# Altium schematic sheet ngp-main.SchDoc
size A3
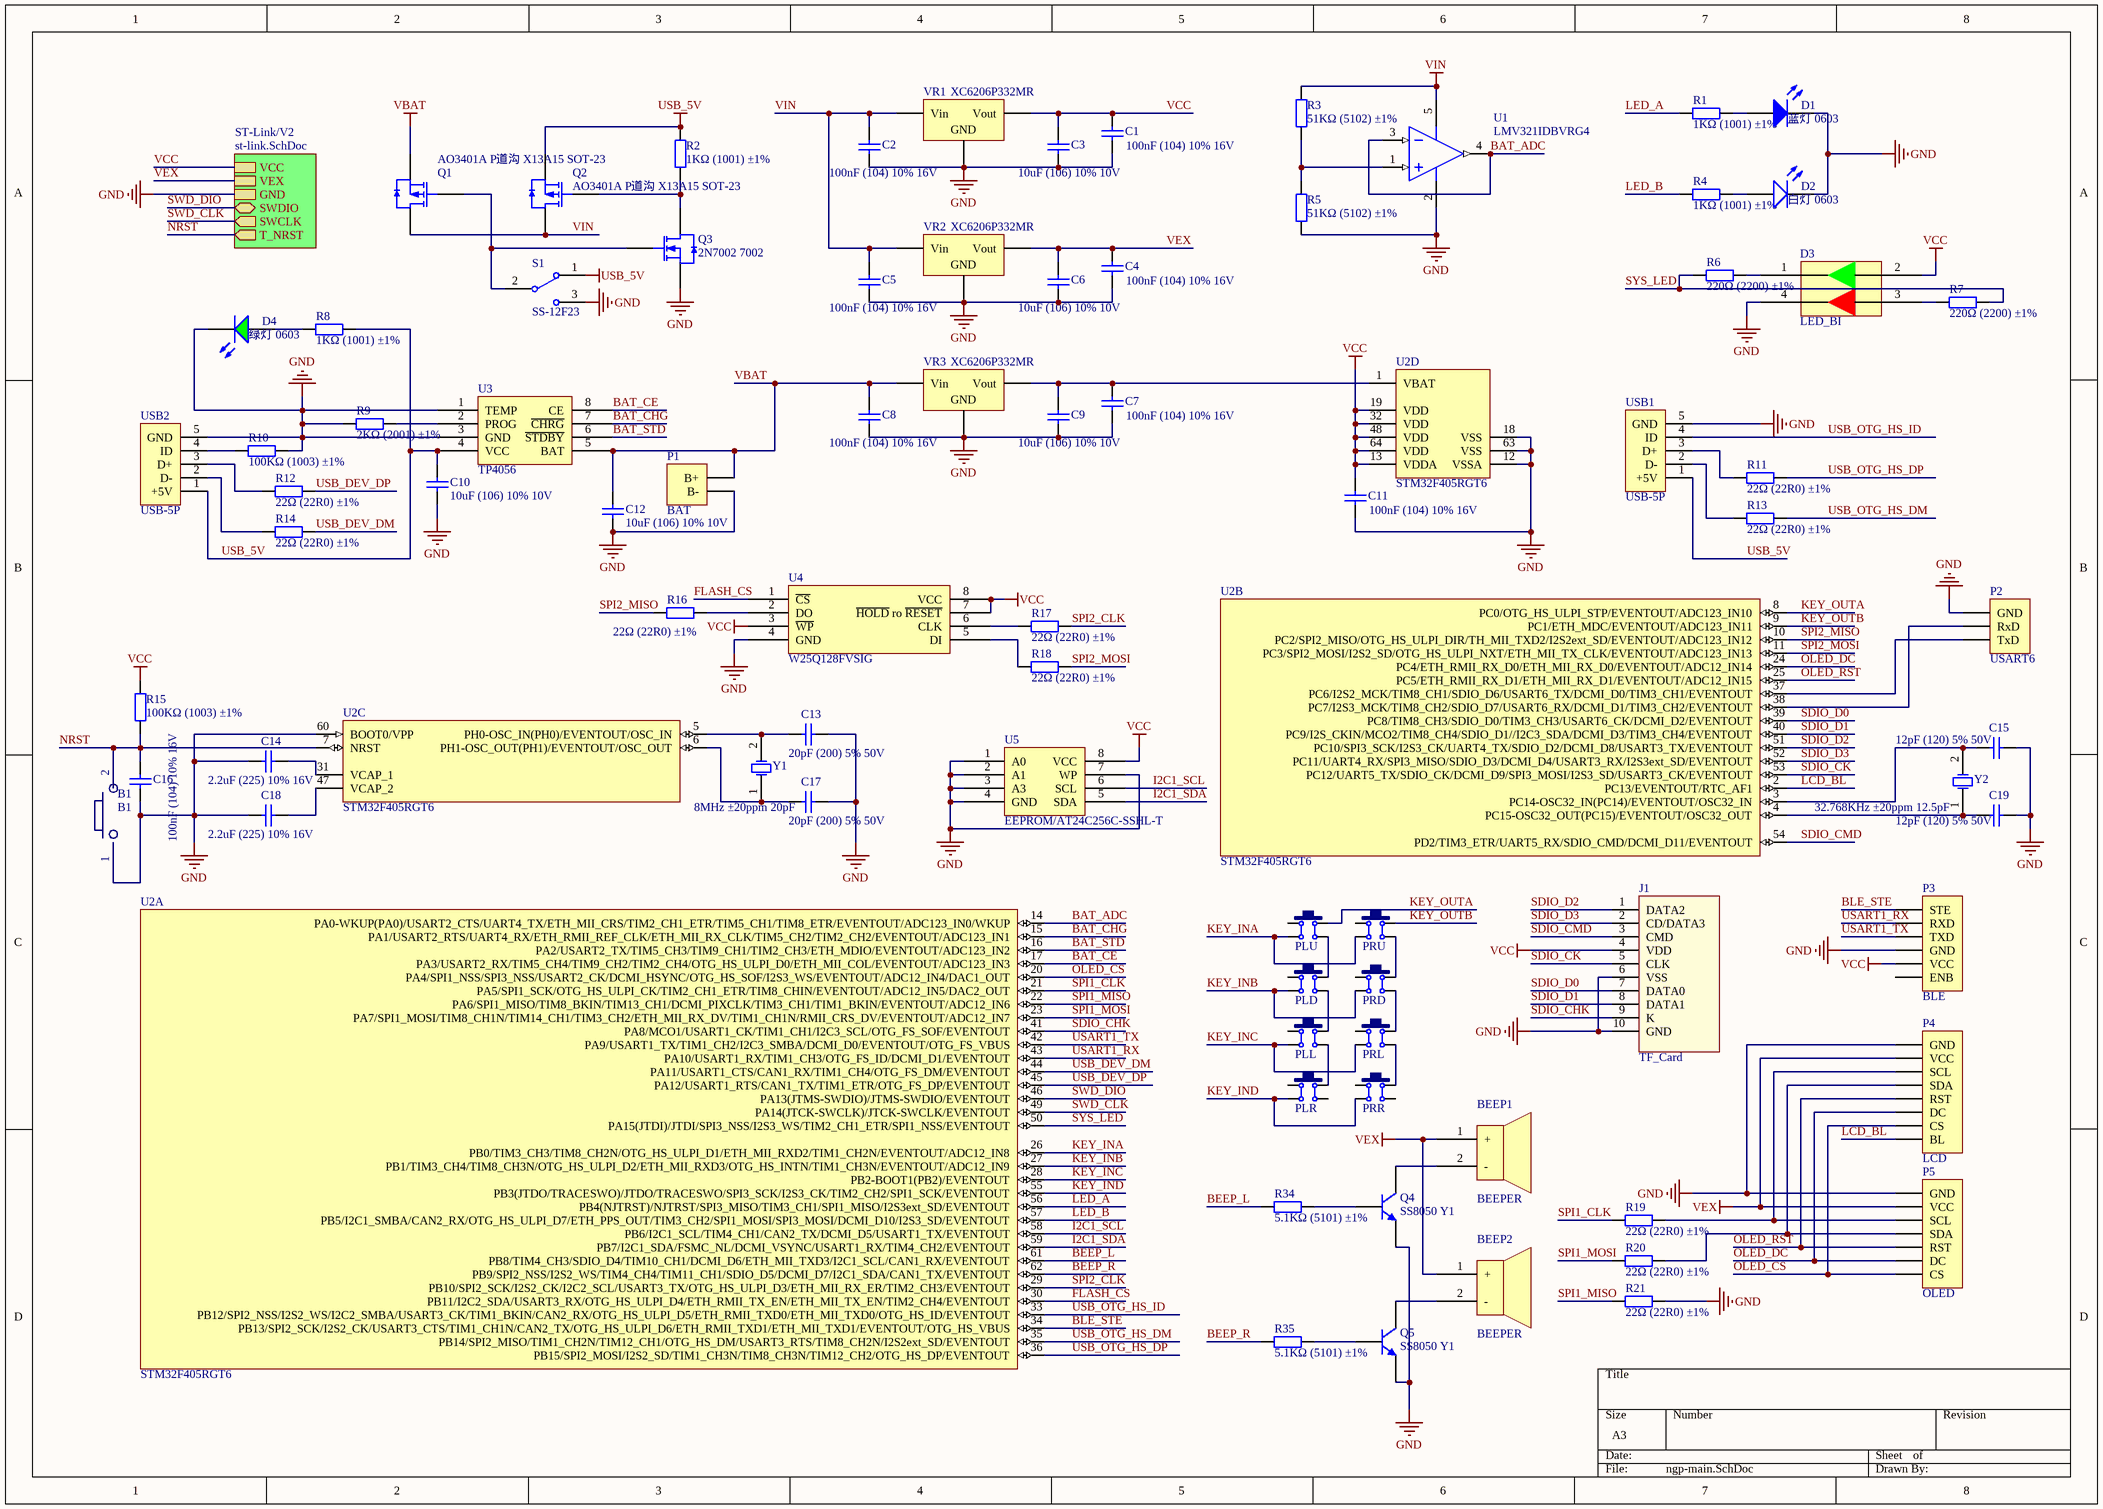
[diagram p0: ngp-main.SchDoc]

## Parts
B1  B1  [MetalButton]
BEEP1  BEEPER  [BEEPER]
BEEP2  BEEPER  [BEEPER]
C1  100nF (104) 10% 16V  [0402_C]
C2  100nF (104) 10% 16V  [0402_C]
C3  10uF (106) 10% 10V  [0603_C]
C4  100nF (104) 10% 16V  [0402_C]
C5  100nF (104) 10% 16V  [0402_C]
C6  10uF (106) 10% 10V  [0603_C]
C7  100nF (104) 10% 16V  [0402_C]
C8  100nF (104) 10% 16V  [0402_C]
C9  10uF (106) 10% 10V  [0603_C]
C10  10uF (106) 10% 10V  [0603_C]
C11  100nF (104) 10% 16V  [0402_C]
C12  10uF (106) 10% 10V  [0603_C]
C13  20pF (200) 5% 50V  [0402_C]
C14  2.2uF (225) 10% 16V  [0603_C]
C15  12pF (120) 5% 50V  [0402_C]
C16  100nF (104) 10% 16V  [0402_C]
C17  20pF (200) 5% 50V  [0402_C]
C18  2.2uF (225) 10% 16V  [0603_C]
C19  12pF (120) 5% 50V  [0402_C]
D1  蓝灯 0603  [0603_LED_S1]
D2  白灯 0603  [0603_LED_S1]
D3  LED_BI  [LED_BI]
D4  绿灯 0603  [0603_LED_S1]
J1  TF_Card  [Micro SD]
P1  BAT  [HDR1X2]
P2  USART6  [HDR1X3H]
P3  BLE  [HDR1X6]
P4  LCD  [HDR1X8]
P5  OLED  [HDR1X7]
PLD  6x6x5  [TSW SMD-6*6*5]  (value not drawn)
PLL  6x6x5  [TSW SMD-6*6*5]  (value not drawn)
PLR  6x6x5  [TSW SMD-6*6*5]  (value not drawn)
PLU  6x6x5  [TSW SMD-6*6*5]  (value not drawn)
PRD  6x6x5  [TSW SMD-6*6*5]  (value not drawn)
PRL  6x6x5  [TSW SMD-6*6*5]  (value not drawn)
PRR  6x6x5  [TSW SMD-6*6*5]  (value not drawn)
PRU  6x6x5  [TSW SMD-6*6*5]  (value not drawn)
Q1  AO3401A P道沟 X13A15 SOT-23  [SOT-23-3L]
Q2  AO3401A P道沟 X13A15 SOT-23  [SOT-23-3L]
Q3  2N7002 7002  [SOT-23(SOT-23-3)]
Q4  SS8050 Y1  [SOT-23(SOT-23-3)]
Q5  SS8050 Y1  [SOT-23(SOT-23-3)]
R1  1KΩ (1001) ±1%  [0402_R]
R2  1KΩ (1001) ±1%  [0402_R]
R3  51KΩ (5102) ±1%  [0402_R]
R4  1KΩ (1001) ±1%  [0402_R]
R5  51KΩ (5102) ±1%  [0402_R]
R6  220Ω (2200) ±1%  [0402_R]
R7  220Ω (2200) ±1%  [0402_R]
R8  1KΩ (1001) ±1%  [0402_R]
R9  2KΩ (2001) ±1%  [0402_R]
R10  100KΩ (1003) ±1%  [0402_R]
R11  22Ω (22R0) ±1%  [0402_R]
R12  22Ω (22R0) ±1%  [0402_R]
R13  22Ω (22R0) ±1%  [0402_R]
R14  22Ω (22R0) ±1%  [0402_R]
R15  100KΩ (1003) ±1%  [0402_R]
R16  22Ω (22R0) ±1%  [0402_R]
R17  22Ω (22R0) ±1%  [0402_R]
R18  22Ω (22R0) ±1%  [0402_R]
R19  22Ω (22R0) ±1%  [0402_R]
R20  22Ω (22R0) ±1%  [0402_R]
R21  22Ω (22R0) ±1%  [0402_R]
R34  5.1KΩ (5101) ±1%  [0402_R]
R35  5.1KΩ (5101) ±1%  [0402_R]
S1  SS-12F23  [MSK-12C01-07]
U1  LMV321IDBVRG4  [SOT-23-5]
U2  STM32F405RGT6  [LQFP-64_10x10x05P]  (parts A,B,C,D of 4)
U3  TP4056  [SOP-8_EP_150mil]
U4  W25Q128FVSIG  [SOIC-8_208mil]
U5  EEPROM/AT24C256C-SSHL-T  [SOIC-8_150mil]
USB1  USB-5P  [USB-MICRO_D]
USB2  USB-5P  [USB-MICRO_D]
VR1  XC6206P332MR  [SOT-23-3L]
VR2  XC6206P332MR  [SOT-23-3L]
VR3  XC6206P332MR  [SOT-23-3L]
Y1  8MHz ±20ppm 20pF  [SMD-5032_2P]
Y2  32.768KHz ±20ppm 12.5pF  [SMD-3215_2P FC - 135]

## Sub-sheets
ST-Link/V2 = st-link.SchDoc: VCC, VEX, GND, SWDIO (bidir), SWCLK (out), T_NRST (out)

## Nets
GND: B1.1 C1.1 C2.1 C3.2 C4.1 C5.1 C6.2 C7.1 C8.1 C9.2 C10.1 C11.1 C12.2 C13.2 C14.1 C15.2 C16.1 C17.2 C18.1 C19.2 D1.K D2.K D3.4 D4.K J1.6(VSS) J1.10(GND) P1.1(B-) P2.1(GND) P3.4(GND) P4.1(GND) P5.1(GND) Q3.2(S) Q4.2(E) Q5.2(E) R5.1 R9.1 R10.2 R21.2 S1.3 U1.2(V-) U2.12(VSSA) U2.18(VSS) U2.60(BOOT0/VPP) U2.63(VSS) U3.1(TEMP) U3.3(GND) U4.4(GND) U5.1(A0) U5.2(A1) U5.3(A3) U5.4(GND) U5.7(WP) USB1.5(GND) USB2.5(GND) VR1.1(GND) VR2.1(GND) VR3.1(GND) ; sheet ST-Link/V2/GND
USB_5V: C10.2 Q2.2(S) R2.1 R8.1 S1.1 U3.4(VCC) USB1.1(+5V) USB2.1(+5V)
VBAT: C8.2 C12.1 P1.2(B+) Q1.2(S) U3.5(BAT) VR3.3(Vin)
VCC: C1.2 C3.1 C11.2 D3.2 J1.4(VDD) P3.5(VCC) R15.2 U2.13(VDDA) U2.19(VDD) U2.32(VDD) U2.48(VDD) U2.64(VDD) U4.3(~{WP}) U4.7(~{HOLD}_ro_~{RESET}) U4.8(VCC) U5.8(VCC) VR1.2(Vout) ; sheet ST-Link/V2/VCC
VEX: BEEP1.1(+) BEEP2.1(+) C4.2 C6.1 P4.2(VCC) P5.2(VCC) VR2.2(Vout) ; sheet ST-Link/V2/VEX
VIN: C2.2 C5.2 Q1.3(D) Q2.3(D) R3.2 U1.5(V+) VR1.3(Vin) VR2.3(Vin)
BAT_ADC: U1.3(IN-) U1.4(OUT) U2.14(PA0-WKUP(PA0)/USART2_CTS/UART4_TX/ETH_MII_CRS/TIM2_CH1_ETR/TIM5_CH1/TIM8_ETR/EVENTOUT/ADC123_IN0/WKUP)
BAT_CE: U2.17(PA3/USART2_RX/TIM5_CH4/TIM9_CH2/TIM2_CH4/OTG_HS_ULPI_D0/ETH_MII_COL/EVENTOUT/ADC123_IN3) U3.8(CE)
BAT_CHG: U2.15(PA1/USART2_RTS/UART4_RX/ETH_RMII_REF_CLK/ETH_MII_RX_CLK/TIM5_CH2/TIM2_CH2/EVENTOUT/ADC123_IN1) U3.7(~{CHRG})
BAT_STD: U2.16(PA2/USART2_TX/TIM5_CH3/TIM9_CH1/TIM2_CH3/ETH_MDIO/EVENTOUT/ADC123_IN2) U3.6(~{STDBY})
BEEP_L: R34.1 U2.61(PB8/TIM4_CH3/SDIO_D4/TIM10_CH1/DCMI_D6/ETH_MII_TXD3/I2C1_SCL/CAN1_RX/EVENTOUT)
BEEP_R: R35.1 U2.62(PB9/SPI2_NSS/I2S2_WS/TIM4_CH4/TIM11_CH1/SDIO_D5/DCMI_D7/I2C1_SDA/CAN1_TX/EVENTOUT)
BLE_STE: P3.1(STE) U2.34(PB13/SPI2_SCK/I2S2_CK/USART3_CTS/TIM1_CH1N/CAN2_TX/OTG_HS_ULPI_D6/ETH_RMII_TXD1/ETH_MII_TXD1/EVENTOUT/OTG_HS_VBUS)
FLASH_CS: U2.30(PB11/I2C2_SDA/USART3_RX/OTG_HS_ULPI_D4/ETH_RMII_TX_EN/ETH_MII_TX_EN/TIM2_CH4/EVENTOUT) U4.1(~{CS})
I2C1_SCL: U2.58(PB6/I2C1_SCL/TIM4_CH1/CAN2_TX/DCMI_D5/USART1_TX/EVENTOUT) U5.6(SCL)
I2C1_SDA: U2.59(PB7/I2C1_SDA/FSMC_NL/DCMI_VSYNC/USART1_RX/TIM4_CH2/EVENTOUT) U5.5(SDA)
KEY_INA: PLU.4 PRU.4 U2.26(PB0/TIM3_CH3/TIM8_CH2N/OTG_HS_ULPI_D1/ETH_MII_RXD2/TIM1_CH2N/EVENTOUT/ADC12_IN8)
KEY_INB: PLD.4 PRD.4 U2.27(PB1/TIM3_CH4/TIM8_CH3N/OTG_HS_ULPI_D2/ETH_MII_RXD3/OTG_HS_INTN/TIM1_CH3N/EVENTOUT/ADC12_IN9)
KEY_INC: PLL.4 PRL.4 U2.28(PB2-BOOT1(PB2)/EVENTOUT)
KEY_IND: PLR.4 PRR.4 U2.55(PB3(JTDO/TRACESWO)/JTDO/TRACESWO/SPI3_SCK/I2S3_CK/TIM2_CH2/SPI1_SCK/EVENTOUT)
KEY_OUTA: PLU.2 U2.8(PC0/OTG_HS_ULPI_STP/EVENTOUT/ADC123_IN10)
KEY_OUTB: PRU.2 U2.9(PC1/ETH_MDC/EVENTOUT/ADC123_IN11)
LCD_BL: P4.8(BL) U2.2(PC13/EVENTOUT/RTC_AF1)
LED_A: R1.2 U2.56(PB4(NJTRST)/NJTRST/SPI3_MISO/TIM3_CH1/SPI1_MISO/I2S3ext_SD/EVENTOUT)
LED_B: R4.2 U2.57(PB5/I2C1_SMBA/CAN2_RX/OTG_HS_ULPI_D7/ETH_PPS_OUT/TIM3_CH2/SPI1_MOSI/SPI3_MOSI/DCMI_D10/I2S3_SD/EVENTOUT)
NRST: B1.2 C16.2 R15.1 U2.7(NRST) ; sheet ST-Link/V2/T_NRST
OLED_CS: P4.7(CS) P5.7(CS) U2.20(PA4/SPI1_NSS/SPI3_NSS/USART2_CK/DCMI_HSYNC/OTG_HS_SOF/I2S3_WS/EVENTOUT/ADC12_IN4/DAC1_OUT)
OLED_DC: P4.6(DC) P5.6(DC) U2.24(PC4/ETH_RMII_RX_D0/ETH_MII_RX_D0/EVENTOUT/ADC12_IN14)
OLED_RST: P4.5(RST) P5.5(RST) U2.25(PC5/ETH_RMII_RX_D1/ETH_MII_RX_D1/EVENTOUT/ADC12_IN15)
SDIO_CHK: J1.9(K) U2.41(PA8/MCO1/USART1_CK/TIM1_CH1/I2C3_SCL/OTG_FS_SOF/EVENTOUT)
SDIO_CK: J1.5(CLK) U2.53(PC12/UART5_TX/SDIO_CK/DCMI_D9/SPI3_MOSI/I2S3_SD/USART3_CK/EVENTOUT)
SDIO_CMD: J1.3(CMD) U2.54(PD2/TIM3_ETR/UART5_RX/SDIO_CMD/DCMI_D11/EVENTOUT)
SDIO_D0: J1.7(DATA0) U2.39(PC8/TIM8_CH3/SDIO_D0/TIM3_CH3/USART6_CK/DCMI_D2/EVENTOUT)
SDIO_D1: J1.8(DATA1) U2.40(PC9/I2S_CKIN/MCO2/TIM8_CH4/SDIO_D1//I2C3_SDA/DCMI_D3/TIM3_CH4/EVENTOUT)
SDIO_D2: J1.1(DATA2) U2.51(PC10/SPI3_SCK/I2S3_CK/UART4_TX/SDIO_D2/DCMI_D8/USART3_TX/EVENTOUT)
SDIO_D3: J1.2(CD/DATA3) U2.52(PC11/UART4_RX/SPI3_MISO/SDIO_D3/DCMI_D4/USART3_RX/I2S3ext_SD/EVENTOUT)
SPI1_CLK: R19.1 U2.21(PA5/SPI1_SCK/OTG_HS_ULPI_CK/TIM2_CH1_ETR/TIM8_CHIN/EVENTOUT/ADC12_IN5/DAC2_OUT)
SPI1_MISO: R21.1 U2.22(PA6/SPI1_MISO/TIM8_BKIN/TIM13_CH1/DCMI_PIXCLK/TIM3_CH1/TIM1_BKIN/EVENTOUT/ADC12_IN6)
SPI1_MOSI: R20.1 U2.23(PA7/SPI1_MOSI/TIM8_CH1N/TIM14_CH1/TIM3_CH2/ETH_MII_RX_DV/TIM1_CH1N/RMII_CRS_DV/EVENTOUT/ADC12_IN7)
SPI2_CLK: R17.2 U2.29(PB10/SPI2_SCK/I2S2_CK/I2C2_SCL/USART3_TX/OTG_HS_ULPI_D3/ETH_MII_RX_ER/TIM2_CH3/EVENTOUT)
SPI2_MISO: R16.1 U2.10(PC2/SPI2_MISO/OTG_HS_ULPI_DIR/TH_MII_TXD2/I2S2ext_SD/EVENTOUT/ADC123_IN12)
SPI2_MOSI: R18.2 U2.11(PC3/SPI2_MOSI/I2S2_SD/OTG_HS_ULPI_NXT/ETH_MII_TX_CLK/EVENTOUT/ADC123_IN13)
SWD_CLK: U2.49(PA14(JTCK-SWCLK)/JTCK-SWCLK/EVENTOUT) ; sheet ST-Link/V2/SWCLK
SWD_DIO: U2.46(PA13(JTMS-SWDIO)/JTMS-SWDIO/EVENTOUT) ; sheet ST-Link/V2/SWDIO
SYS_LED: R6.1 R7.2 U2.50(PA15(JTDI)/JTDI/SPI3_NSS/I2S3_WS/TIM2_CH1_ETR/SPI1_NSS/EVENTOUT)
USART1_RX: P3.2(RXD) U2.43(PA10/USART1_RX/TIM1_CH3/OTG_FS_ID/DCMI_D1/EVENTOUT)
USART1_TX: P3.3(TXD) U2.42(PA9/USART1_TX/TIM1_CH2/I2C3_SMBA/DCMI_D0/EVENTOUT/OTG_FS_VBUS)
USB_DEV_DM: R14.2 U2.44(PA11/USART1_CTS/CAN1_RX/TIM1_CH4/OTG_FS_DM/EVENTOUT)
USB_DEV_DP: R12.2 U2.45(PA12/USART1_RTS/CAN1_TX/TIM1_ETR/OTG_FS_DP/EVENTOUT)
USB_OTG_HS_DM: R13.2 U2.35(PB14/SPI2_MISO/TIM1_CH2N/TIM12_CH1/OTG_HS_DM/USART3_RTS/TIM8_CH2N/I2S2ext_SD/EVENTOUT)
USB_OTG_HS_DP: R11.2 U2.36(PB15/SPI2_MOSI/I2S2_SD/TIM1_CH3N/TIM8_CH3N/TIM12_CH2/OTG_HS_DP/EVENTOUT)
USB_OTG_HS_ID: U2.33(PB12/SPI2_NSS/I2S2_WS/I2C2_SMBA/USART3_CK/TIM1_BKIN/CAN2_RX/OTG_HS_ULPI_D5/ETH_RMII_TXD0/ETH_MII_TXD0/OTG_HS_ID/EVENTOUT) USB1.4(ID)
NetBEEP1_2: BEEP1.2(-) Q4.3(C)
NetBEEP2_2: BEEP2.2(-) Q5.3(C)
NetC7_2: C7.2 C9.1 U2.1(VBAT) VR3.2(Vout)
NetC13_1: C13.1 U2.5(PH0-OSC_IN(PH0)/EVENTOUT/OSC_IN) Y1.2(OSC2)
NetC14_2: C14.2 U2.31(VCAP_1)
NetC15_1: C15.1 U2.3(PC14-OSC32_IN(PC14)/EVENTOUT/OSC32_IN) Y2.2(OSC2)
NetC17_1: C17.1 U2.6(PH1-OSC_OUT(PH1)/EVENTOUT/OSC_OUT) Y1.1(OSC1)
NetC18_2: C18.2 U2.47(VCAP_2)
NetC19_1: C19.1 U2.4(PC15-OSC32_OUT(PC15)/EVENTOUT/OSC32_OUT) Y2.1(OSC1)
NetD1_A: D1.A R1.1
NetD2_A: D2.A R4.1
NetD3_1: D3.1 R6.2
NetD3_3: D3.3 R7.1
NetD4_A: D4.A R8.2
NetP2_2: P2.2(RxD) U2.38(PC7/I2S3_MCK/TIM8_CH2/SDIO_D7/USART6_RX/DCMI_D1/TIM3_CH2/EVENTOUT)
NetP2_3: P2.3(TxD) U2.37(PC6/I2S2_MCK/TIM8_CH1/SDIO_D6/USART6_TX/DCMI_D0/TIM3_CH1/EVENTOUT)
NetP4_3: P4.3(SCL) P5.3(SCL) R19.2
NetP4_4: P4.4(SDA) P5.4(SDA) R20.2
NetPLD_2: PLD.2 PLU.3
NetPLD_3: PLD.3 PLL.2
NetPLL_3: PLL.3 PLR.2
NetPRD_2: PRD.2 PRU.3
NetPRD_3: PRD.3 PRL.2
NetPRL_3: PRL.3 PRR.2
NetQ1_1: Q1.1(G) Q3.1(G) S1.2
NetQ2_1: Q2.1(G) Q3.3(D) R2.2
NetQ4_1: Q4.1(B) R34.2
NetQ5_1: Q5.1(B) R35.2
NetR3_1: R3.1 R5.2 U1.1(IN+)
NetR9_2: R9.2 U3.2(PROG)
NetR10_1: R10.1 USB2.4(ID)
NetR11_1: R11.1 USB1.3(D+)
NetR12_1: R12.1 USB2.3(D+)
NetR13_1: R13.1 USB1.2(D-)
NetR14_1: R14.1 USB2.2(D-)
NetR16_2: R16.2 U4.2(DO)
NetR17_1: R17.1 U4.6(CLK)
NetR18_1: R18.1 U4.5(DI)

Not connected (* = marked no-connect by the designer): P3 6(ENB); PLD 1; PLL 1; PLR 1 3; PLU 1; PRD 1; PRL 1; PRR 1 3; PRU 1

## Library data of the parts
B1 = MetalButton
C1 C2 C4 C5 C7 C8 C11 C16 = 0402 100nF (104) 10% 16V: 贴片电容; ComponentLink1Description: 供应商链接; ComponentLink1URL: http://www.szlcsc.com/product/details_1877.html; Package: 0402; Supplier: LC; SuppliersPartNumber: C1525
C3 C6 C9 C10 C12 = 0603 10uF (106) 10% 10V: 贴片电容; ComponentLink1Description: 供应商链接; ComponentLink1URL: http://www.szlcsc.com/product/details_20411.html; Package: 0603; Supplier: LC; SuppliersPartNumber: C19702
C13 C17 = 0402 20pF (200) 5% 50V: 贴片电容; ComponentLink1Description: 供应商链接; ComponentLink1URL: http://www.szlcsc.com/product/details_1906.html; Package: 0402; Supplier: LC; SuppliersPartNumber: C1554
C14 C18 = 0603 2.2uF (225) 10% 16V: 贴片电容; ComponentLink1Description: 供应商链接; ComponentLink1URL: http://www.szlcsc.com/product/details_24366.html; Package: 0603; Supplier: LC; SuppliersPartNumber: C23630
C15 C19 = 0402 12pF (120) 5% 50V: 贴片电容; ComponentLink1Description: 供应商链接; ComponentLink1URL: http://www.szlcsc.com/product/details_1899.html; Package: 0402; Supplier: LC; SuppliersPartNumber: C1547
D1 = 0603 蓝灯: 发光二极管; ComponentLink1Description: 供应商链接; ComponentLink1URL: http://www.szlcsc.com/product/details_73150.html; Package: 0603; Supplier: LC; SuppliersPartNumber: C72041
D2 = 0603 白灯: 发光二极管; ComponentLink1Description: 供应商链接; ComponentLink1URL: http://www.szlcsc.com/product/details_2663.html; Package: 0603; Supplier: LC; SuppliersPartNumber: C2290
D4 = 0603 绿灯: 发光二极管; ComponentLink1Description: 供应商链接; ComponentLink1URL: http://www.szlcsc.com/product/details_73152.html; Package: 0603; Supplier: LC; SuppliersPartNumber: C72043
J1 = TF_Card: TF卡座; 版权归属: 源创客; BOM名称: TF卡座; 学习资源: www.ooocke.com
P1 = Header 2: Header, 2-Pin; LatestRevisionDate: 17-Jul-2002; LatestRevisionNote: Re-released for DXP Platform.; Publisher: Altium Limited
P2 = Header 3H: Header, 3-Pin, Right Angle; LatestRevisionDate: 17-Jul-2002; LatestRevisionNote: Re-released for DXP Platform.; Publisher: Altium Limited
P3 = Header 6: Header, 6-Pin; LatestRevisionDate: 17-Jul-2002; LatestRevisionNote: Re-released for DXP Platform.; Publisher: Altium Limited
P4 = Header 8: Header, 8-Pin; LatestRevisionDate: 17-Jul-2002; LatestRevisionNote: Re-released for DXP Platform.; Publisher: Altium Limited
P5 = Header 7: Header, 7-Pin; LatestRevisionDate: 17-Jul-2002; LatestRevisionNote: Re-released for DXP Platform.; Publisher: Altium Limited
PLD PLL PLR PLU PRD PRL PRR PRU = TSW SMD-6x6: 贴片6x6轻触开关; 版权归属: 源创客; BOM名称: 贴片6x6轻触开关; 学习资源: www.ooocke.com
Q1 Q2 = AO3401A P道沟 X13A15 SOT-23: MOS(场效应管); ComponentLink1Description: 供应商链接; ComponentLink1URL: http://www.szlcsc.com/product/details_15801.html; Package: SOT-23; Supplier: LC; SuppliersPartNumber: C15127
Q3 = 2N7002 7002: MOS(场效应管); ComponentLink1Description: 供应商链接; ComponentLink1URL: http://www.szlcsc.com/product/details_9040.html; Package: SOT-23(SOT-23-3); Supplier: LC; SuppliersPartNumber: C8545
Q4 Q5 = SOT-23 SS8050 Y1: 三极管; ComponentLink1Description: 供应商链接; ComponentLink1URL: http://www.szlcsc.com/product/details_2507.html; Package: SOT-23; Supplier: LC; SuppliersPartNumber: C2150
R1 R2 R4 R8 = 0402 1KΩ (1001) 1%: 贴片电阻; ComponentLink1Description: 供应商链接; ComponentLink1URL: http://www.szlcsc.com/product/details_12256.html; Package: 0402; Supplier: LC; SuppliersPartNumber: C11702
R3 R5 = 0402 51KΩ (5102) 1%: 贴片电阻; ComponentLink1Description: 供应商链接; ComponentLink1URL: http://www.szlcsc.com/product/details_26537.html; Package: 0402; Supplier: LC; SuppliersPartNumber: C25794
R6 R7 = 0402 220Ω (2200) 1%: 贴片电阻; ComponentLink1Description: 供应商链接; ComponentLink1URL: http://www.szlcsc.com/product/details_25834.html; Package: 0402; Supplier: LC; SuppliersPartNumber: C25091
R9 = 0402 2KΩ (2001) 1%: 贴片电阻; ComponentLink1Description: 供应商链接; ComponentLink1URL: http://www.szlcsc.com/product/details_4516.html; Package: 0402; Supplier: LC; SuppliersPartNumber: C4109
R10 R15 = 0402 100KΩ (1003) 1%: 贴片电阻; ComponentLink1Description: 供应商链接; ComponentLink1URL: http://www.szlcsc.com/product/details_26484.html; Package: 0402; Supplier: LC; SuppliersPartNumber: C25741
R11-R14 R16-R21 = 0402 22Ω (22R0) 1%: 贴片电阻; ComponentLink1Description: 供应商链接; ComponentLink1URL: http://www.szlcsc.com/product/details_25835.html; Package: 0402; Supplier: LC; SuppliersPartNumber: C25092
R34 R35 = 0402 5.1KΩ (5101) 1%: 贴片电阻; ComponentLink1Description: 供应商链接; ComponentLink1URL: http://www.szlcsc.com/product/details_26648.html; Package: 0402; Supplier: LC; SuppliersPartNumber: C25905
S1 = SSW-1P: 1路波动开关; BOM名称: 波动开关; 版权归属: 源创客; 学习资源: www.ooocke.com
U1 = LMV321IDBVRG4_[C7972]: 运放; ComponentLink1Description: 供应商链接; ComponentLink1URL: http://www.szlcsc.com/product/details_8449.html; Package: SOT-23-5; Supplier: LC; SuppliersPartNumber: C7972
U2 = STM32F405RGT6: ARM; ComponentLink1Description: 供应商链接; ComponentLink1URL: http://www.szlcsc.com/product/details_16424.html; Package: LQFP-64_10x10x05P; Supplier: LC; SuppliersPartNumber: C15742
U3 = TP4056_[C16581]: 电池电源管理; ComponentLink1Description: 供应商链接; ComponentLink1URL: http://www.szlcsc.com/product/details_17264.html; Package: SOP-8_EP_150mil; Supplier: LC; SuppliersPartNumber: C16581
U4 = W25Q128FVSIG_[C35101]: Flash ROM; ComponentLink1Description: 供应商链接; ComponentLink1URL: http://www.szlcsc.com/product/details_36072.html; Package: SOIC-8; Supplier: LC; SuppliersPartNumber: C35101
U5 = EEPROM/AT24C256C-SSHL-T_[C6482]: EEPROM; ComponentLink1Description: 供应商链接; ComponentLink1URL: http://www.szlcsc.com/product/details_6947.html; Package: SOIC-8_150mil; Supplier: LC; SuppliersPartNumber: C6482
USB1 USB2 = USB-5P: 微型USB母座; 版权归属: 源创客; BOM名称: 微型USB母座; 学习资源: www.ooocke.com
VR1-VR3 = SOT-23 XC6206P332MR: 低压差线性稳压(LDO); ComponentLink1Description: 供应商链接; ComponentLink1URL: http://www.szlcsc.com/product/details_5896.html; Package: SOT-23; Supplier: LC; SuppliersPartNumber: C5446
Y1 = SMD-5032_2P 8MHz 20ppm 20pF: 贴片晶振; ComponentLink1Description: 供应商链接; ComponentLink1URL: http://www.szlcsc.com/product/details_117214.html; Package: SMD-5032_2P; Supplier: LC; SuppliersPartNumber: C115962
Y2 = SMD-3215_2P 32.768KHz 20ppm 12.5pF: 贴片晶振; ComponentLink1Description: 供应商链接; ComponentLink1URL: http://www.szlcsc.com/product/details_33310.html; Package: SMD-3215_2P; Supplier: LC; SuppliersPartNumber: C32346